# EAGLE design schematic_gprs_old (EAGLE 7.5.0)
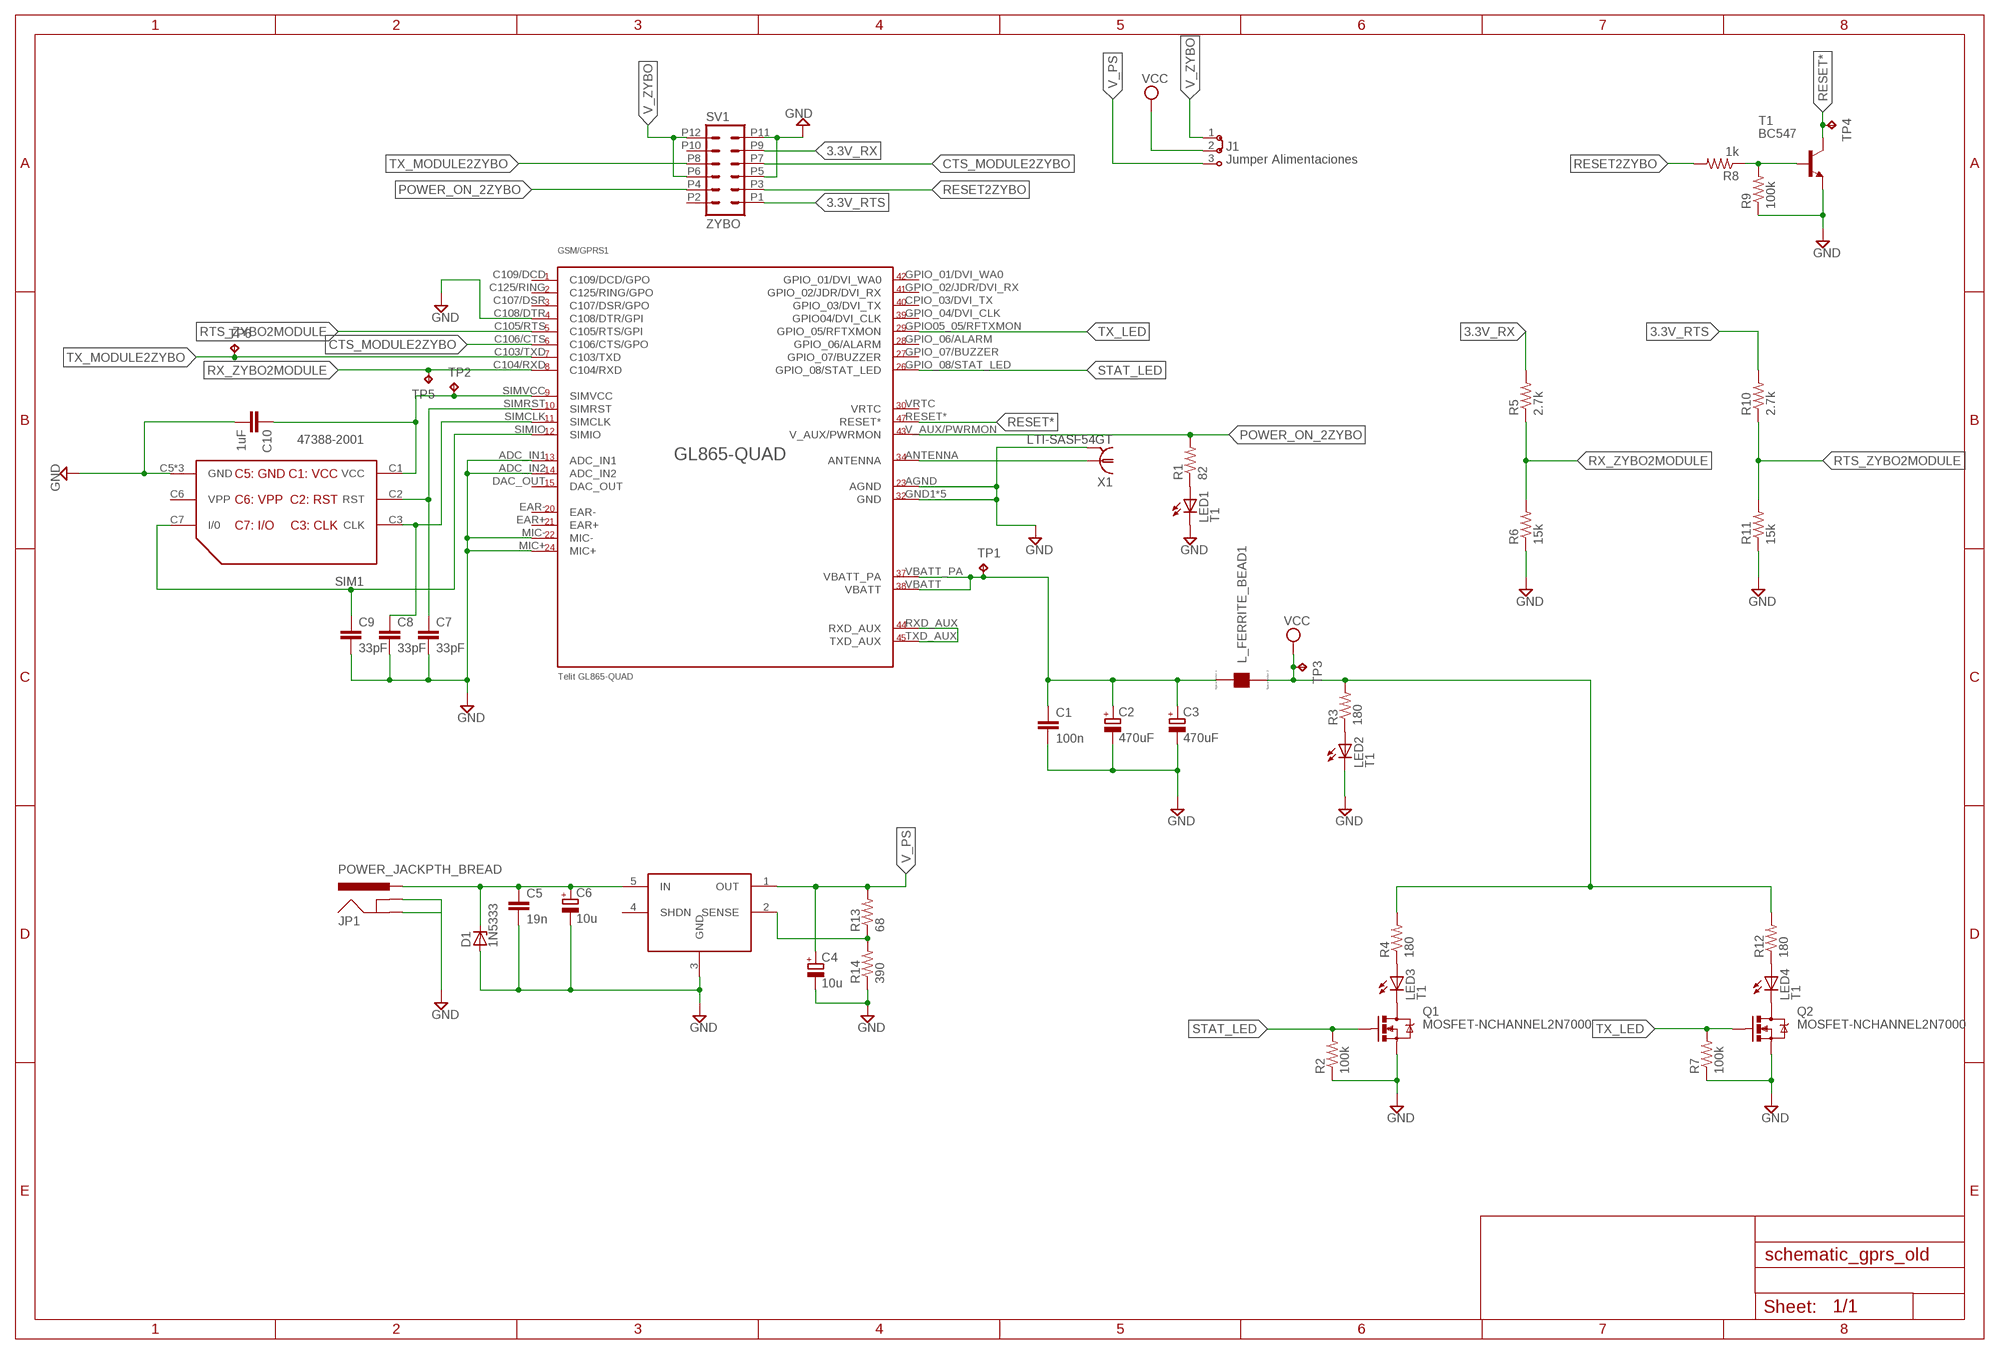
[diagram p0: schematic, sheet 1]

## Parts
C1  100n  C2.5/2  [C2.5-2]
C2  470uF  CPOL-EUE3.5-8  [E3,5-8]
C3  470uF  CPOL-EUE3.5-8  [E3,5-8]
C4  10u  CPOL-EUE2-5  [E2-5]
C5  19n  C-EU050-025X075  [C050-025X075]
C6  10u  CPOL-EUE1.8-4  [E1,8-4]
C7  33pF  C-EU025-024X044  [C025-024X044]
C8  33pF  C-EU025-024X044  [C025-024X044]
C9  33pF  C-EU025-024X044  [C025-024X044]
C10  1uF  CAPKIT  [CAP-PTH-SMALL-KIT]
D1  1N5333  [C1702-15]
GSM/GPRS1  Telit GL865-QUAD  GL865-QUAD  [GL865-QUAD]
J1  Jumper Alimentaciones  J2X2MM  [04C]
JP1  POWER_JACKPTH_BREAD  [POWER_JACK_PTH_BREAD]
L_FERRITE_BEAD1  FERRITEBEAD2  [0207/7]
LED1  T1  LED3MM  [LED3MM]
LED2  T1  LED3MM  [LED3MM]
LED3  T1  LED3MM  [LED3MM]
LED4  T1  LED3MM  [LED3MM]
Q1  MOSFET-NCHANNEL2N7000  [TO-92]
Q2  MOSFET-NCHANNEL2N7000  [TO-92]
R1  82  R-US_0207/7  [0207/7]
R2  100k  R-US_0207/7  [0207/7]
R3  180  R-US_0207/7  [0207/7]
R4  180  R-US_0207/7  [0207/7]
R5  2.7k  R-US_0207/7  [0207/7]
R6  15k  R-US_0207/7  [0207/7]
R7  100k  R-US_0207/7  [0207/7]
R8  1k  R-US_0207/7  [0207/7]
R9  100k  R-US_0207/7  [0207/7]
R10  2.7k  R-US_0207/7  [0207/7]
R11  15k  R-US_0207/7  [0207/7]
R12  180  R-US_0207/7  [0207/7]
R13  68  R-US_0207/7  [0207/7]
R14  390  R-US_0207/7  [0207/7]
SIM1  47388-2001  [47388-2001]
SV1  ZYBO  MA06-2  [MA06-2]
T1  BC547  [TO92]
TP1  TPPAD1-13  [P1-13]
TP2  TPPAD1-13  [P1-13]
TP3  TPPAD1-13  [P1-13]
TP4  TPPAD1-13  [P1-13]
TP5  TPPAD1-13  [P1-13]
TP6  TPPAD1-13  [P1-13]
U$1  LT1528  [Q5-DD]
X1  LTI-SASF54GT  [LTI-SASF54GT]

## Nets
3.3V_RTS: R10.2 SV1.P1
3.3V_RX: R5.2 SV1.P9
CTS_MODULE2ZYBO: GSM/GPRS1.C106/CTS(C106/CTS/GPO) SV1.P7
GND: C1.2 C2.- C3.- C4.- C5.2 C6.- C7.2 C8.2 C9.2 C10.2 D1.A GSM/GPRS1.ADC_IN1 GSM/GPRS1.ADC_IN2 GSM/GPRS1.AGND GSM/GPRS1.C108/DTR(C108/DTR/GPI) GSM/GPRS1.GND1(GND) GSM/GPRS1.GND2(GND) GSM/GPRS1.GND3(GND) GSM/GPRS1.GND4(GND) GSM/GPRS1.GND5(GND) GSM/GPRS1.MIC+ GSM/GPRS1.MIC- JP1.GND JP1.GNDBREAK LED1.K(C) LED2.K(C) Q1.1(S) Q2.1(S) R2.1 R6.1 R7.1 R9.1 R11.1 R14.1 SIM1.C5(GND) SIM1.GND1(GND) SIM1.GND2(GND) SV1.P5 SV1.P11 T1.1(E) U$1.3(GND) X1.2 X1.3 X1.4 X1.5
N$1: GSM/GPRS1.ANTENNA X1.1
N$2: C10.1 GSM/GPRS1.SIMVCC SIM1.C1(VCC) TP2.TP
N$3: LED4.A R12.1
N$4: C7.1 GSM/GPRS1.SIMRST SIM1.C2(RST)
N$5: C8.1 GSM/GPRS1.SIMCLK SIM1.C3(CLK)
N$6: C9.1 GSM/GPRS1.SIMIO SIM1.C7(I/0)
N$7: R8.1 R9.2 T1.2(B)
N$8: LED1.A R1.1
N$9: LED4.K(C) Q2.3(D)
N$10: C1.1 C2.+ C3.+ GSM/GPRS1.VBATT GSM/GPRS1.VBATT_PA L_FERRITE_BEAD1.1(A) TP1.TP
N$11: C5.1 C6.+ D1.C JP1.PWR U$1.5(IN)
N$12: LED3.A R4.1
N$13: LED3.K(C) Q1.3(D)
N$14: R13.1 R14.2 U$1.2(SENSE)
N$15: LED2.A R3.1
N$17: GSM/GPRS1.RXD_AUX GSM/GPRS1.TXD_AUX
POWER_ON_2ZYBO: GSM/GPRS1.V_AUX/PWRMON R1.2 SV1.P4
RESET2ZYBO: R8.2 SV1.P3
RESET*: GSM/GPRS1.RESET* T1.3(C) TP4.TP
RTS_ZYBO2MODULE: GSM/GPRS1.C105/RTS(C105/RTS/GPI) R10.1 R11.2
RX_ZYBO2MODULE: GSM/GPRS1.C104/RXD R5.1 R6.2 TP5.TP
STAT_LED: GSM/GPRS1.GPIO_08/STAT_LED Q1.2(G) R2.2
TX_LED: GSM/GPRS1.GPIO05_05/RFTXMON(GPIO_05/RFTXMON) Q2.2(G) R7.2
TX_MODULE2ZYBO: GSM/GPRS1.C103/TXD SV1.P8 TP6.TP
V_PS: C4.+ J1.3 R13.2 U$1.1(OUT)
V_ZYBO: J1.1 SV1.P6 SV1.P12
VCC: J1.2 L_FERRITE_BEAD1.2(B) R3.2 R4.2 R12.2 TP3.TP
Unconnected: GSM/GPRS1.C107/DSR(C107/DSR/GPO) GSM/GPRS1.C109/DCD(C109/DCD/GPO) GSM/GPRS1.C125/RING(C125/RING/GPO) GSM/GPRS1.CPIO_03/DVI_TX(GPIO_03/DVI_TX) GSM/GPRS1.DAC_OUT GSM/GPRS1.EAR+ GSM/GPRS1.EAR- GSM/GPRS1.GPIO_01/DVI_WA0 GSM/GPRS1.GPIO_02/JDR/DVI_RX GSM/GPRS1.GPIO_04/DVI_CLK(GPIO04/DVI_CLK) GSM/GPRS1.GPIO_06/ALARM GSM/GPRS1.GPIO_07/BUZZER GSM/GPRS1.VRTC SIM1.C6(VPP) SV1.P2 SV1.P10 U$1.4(SHDN)

## Library data of the parts
C1 = capacitor-wima:C: CAPACITOR naming: grid - package width
C2-C4 C6 = resistor:CPOL-EU: POLARIZED CAPACITOR, European symbol
C5 = resistor:C-EU: CAPACITOR, European symbol
C7-C9 = rcl:C-EU: CAPACITOR, European symbol
C10 = SparkFun-Capacitors:CAP: Capacitor Standard 0603 ceramic capacitor, and 0.1" leaded capacitor.
D1 = diode:1N5333: Z DIODE 3.3 V, 5W, 5 percent (Motorola)
GSM/GPRS1 = TelitGL865:GL865-QUAD: Telit GSM/GPRS module GL865-DUAL and GL865-QUAD.
J1 = jumper:J2: Jumper switch 2 x 2.5 mm
JP1 = SparkFun-Connectors:POWER_JACK: Power Jack This is the standard 5.5mm barrel jack for power. The PTH is the most common, proven, reliable, footprint. The Slot footprint only works if the mill layer is transmitted to the PCB fab house so be warned. Mating wall wart : TOL-00298 (and others); PROD_ID: PRT-10811
L_FERRITE_BEAD1 = sym:FERRITEBEAD2: A Ferrite Bead(Alternate symbol)
LED1-LED4 = led:LED: LED OSRAM: - CHIPLED LG R971, LG N971, LY N971, LG Q971, LY Q971, LO R971, LY R971 LH N974, LH R974 LS Q976, LO Q976, LY Q976 LO Q996 - Hyper CHIPLED LW Q18S LB Q993, LB Q99A, LB R99A - SideLED LS A670, LO A670, LY A670, LG A670, LP A670 LB A673, LV A673, LT A673, LW A673 LH A674 LY A675 LS A676, LA A676, LO A676, LY A676, LW A676 LS A679, LY A679, LG A679 - Hyper Micro SIDELED® LS Y876, LA Y876, LO Y876, LY Y876 LT Y87S - SmartLED LW L88C, LW L88S LB L89C, LB L89S, LG L890 LS L89K, LO L89K, LY L89K LS L896, LA L896, LO L896, LY L896 - TOPLED LS T670, LO T670, LY T670, LG T670, LP T670 LSG T670, LSP T670, LSY T670, LOP T670, LYG T670 LG T671, LOG T671, LSG T671 LB T673, LV T673, LT T673, LW T673 LH T674 LS T676, LA T676, LO T676, LY T676, LB T676, LH T676, LSB T676, LW T676 LB T67C, LV T67C, LT T67C, LS T67K, LO T67K, LY T67K, LW E67C LS E67B, LA E67B, LO E67B, LY E67B, LB E67C, LV E67C, LT E67C LW T67C LS T679, LY T679, LG T679 LS T770, LO T770, LY T770, LG T770, LP T770 LB T773, LV T773, LT T773, LW T773 LH T774 LS E675, LA E675, LY E675, LS T675 LS T776, LA T776, LO T776, LY T776, LB T776 LHGB T686 LT T68C, LB T68C - Hyper Mini TOPLED® LB M676 - Mini TOPLED Santana® LG M470 LS M47K, LO M47K, LY M47K Source: http://www.osram.convergy.de LUXEON: - LUMILED® LXK2-PW12-R00, LXK2-PW12-S00, LXK2-PW14-U00, LXK2-PW14-V00 LXK2-PM12-R00, LXK2-PM12-S00, LXK2-PM14-U00 LXK2-PE12-Q00, LXK2-PE12-R00, LXK2-PE12-S00, LXK2-PE14-T00, LXK2-PE14-U00 LXK2-PB12-K00, LXK2-PB12-L00, LXK2-PB12-M00, LXK2-PB14-N00, LXK2-PB14-P00, LXK2-PB14-Q00 LXK2-PR12-L00, LXK2-PR12-M00, LXK2-PR14-Q00, LXK2-PR14-R00 LXK2-PD12-Q00, LXK2-PD12-R00, LXK2-PD12-S00 LXK2-PH12-R00, LXK2-PH12-S00 LXK2-PL12-P00, LXK2-PL12-Q00, LXK2-PL12-R00 Source: www.luxeon.com KINGBRIGHT: KA-3528ASYC Source: www.kingbright.com
Q1 Q2 = SparkFun-DiscreteSemi:MOSFET-NCHANNEL: Common NMOSFET Parts MFG P/N Store ID Prod ID FDD8780 TRANS-09984 SI7820DN TRANS-11055 FDS6630A IC-08089 2N7002PW TRANS-11151 FQP30N06L COM-10213 TRANS-10060 BSS123LT1G TRANS-08345 BSS138 TRANS-00830 BS170 2N7000
R1-R14 = resistor:R-US_: RESISTOR, American symbol
SIM1 = con-molex-simcard:47388-2001: SIM HOLDER 47388-2001 de MOLEX
SV1 = con-lstb:MA06-2: PIN HEADER It was adapted to work with PMOD ZYBO connector
T1 = transistor:BC547: NPN TRANSISTOR
TP1-TP6 = testpad:TP: Test pad
U$1 = SparkFun-PowerIC:LT1528: High current voltage regulator commonly used with GM862 cellular module. Spark Fun Electronics SKU : COM-00311. Footprint may need to have the large paste aperature reduced.
X1 = con-coax:LTI-SASF54GT: SMA vertical PCB thrue hole jack Source: Lighthorse Technologies, inc. SASF54GT.pdf; OC_FARNELL: unknown; OC_NEWARK: unknown

## Board
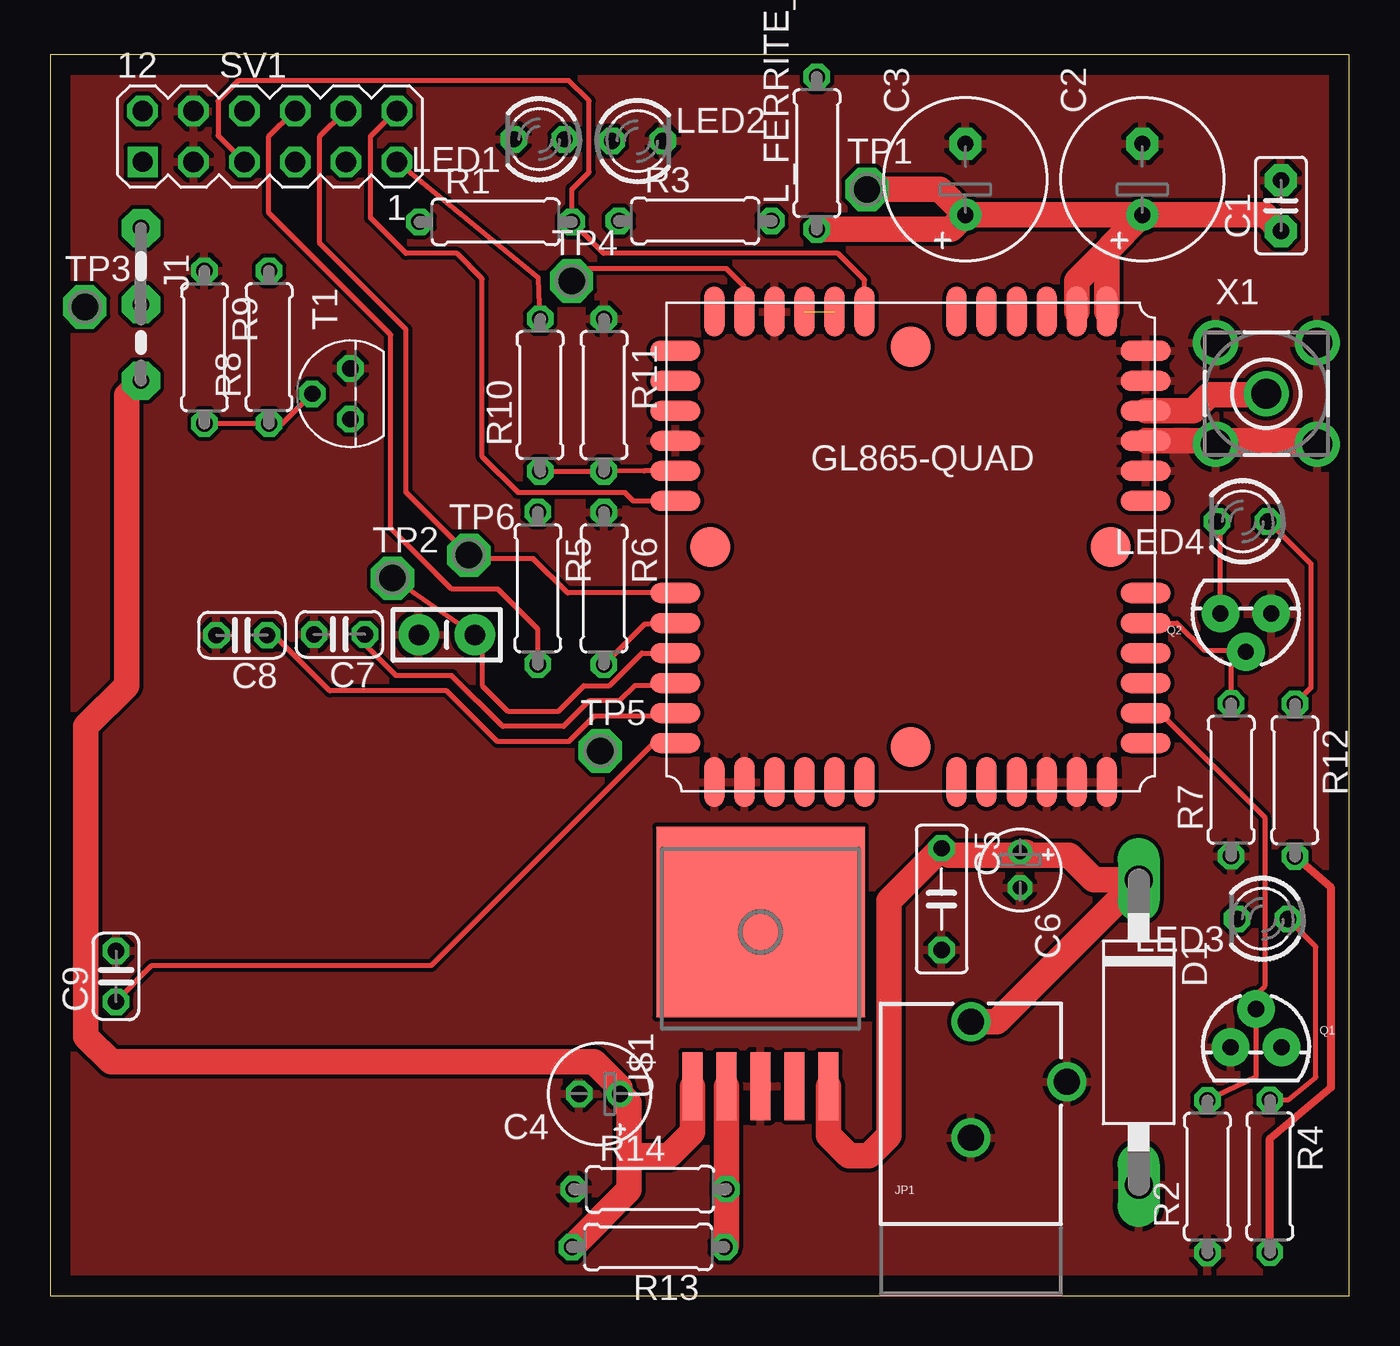
[diagram p1: board, top side]
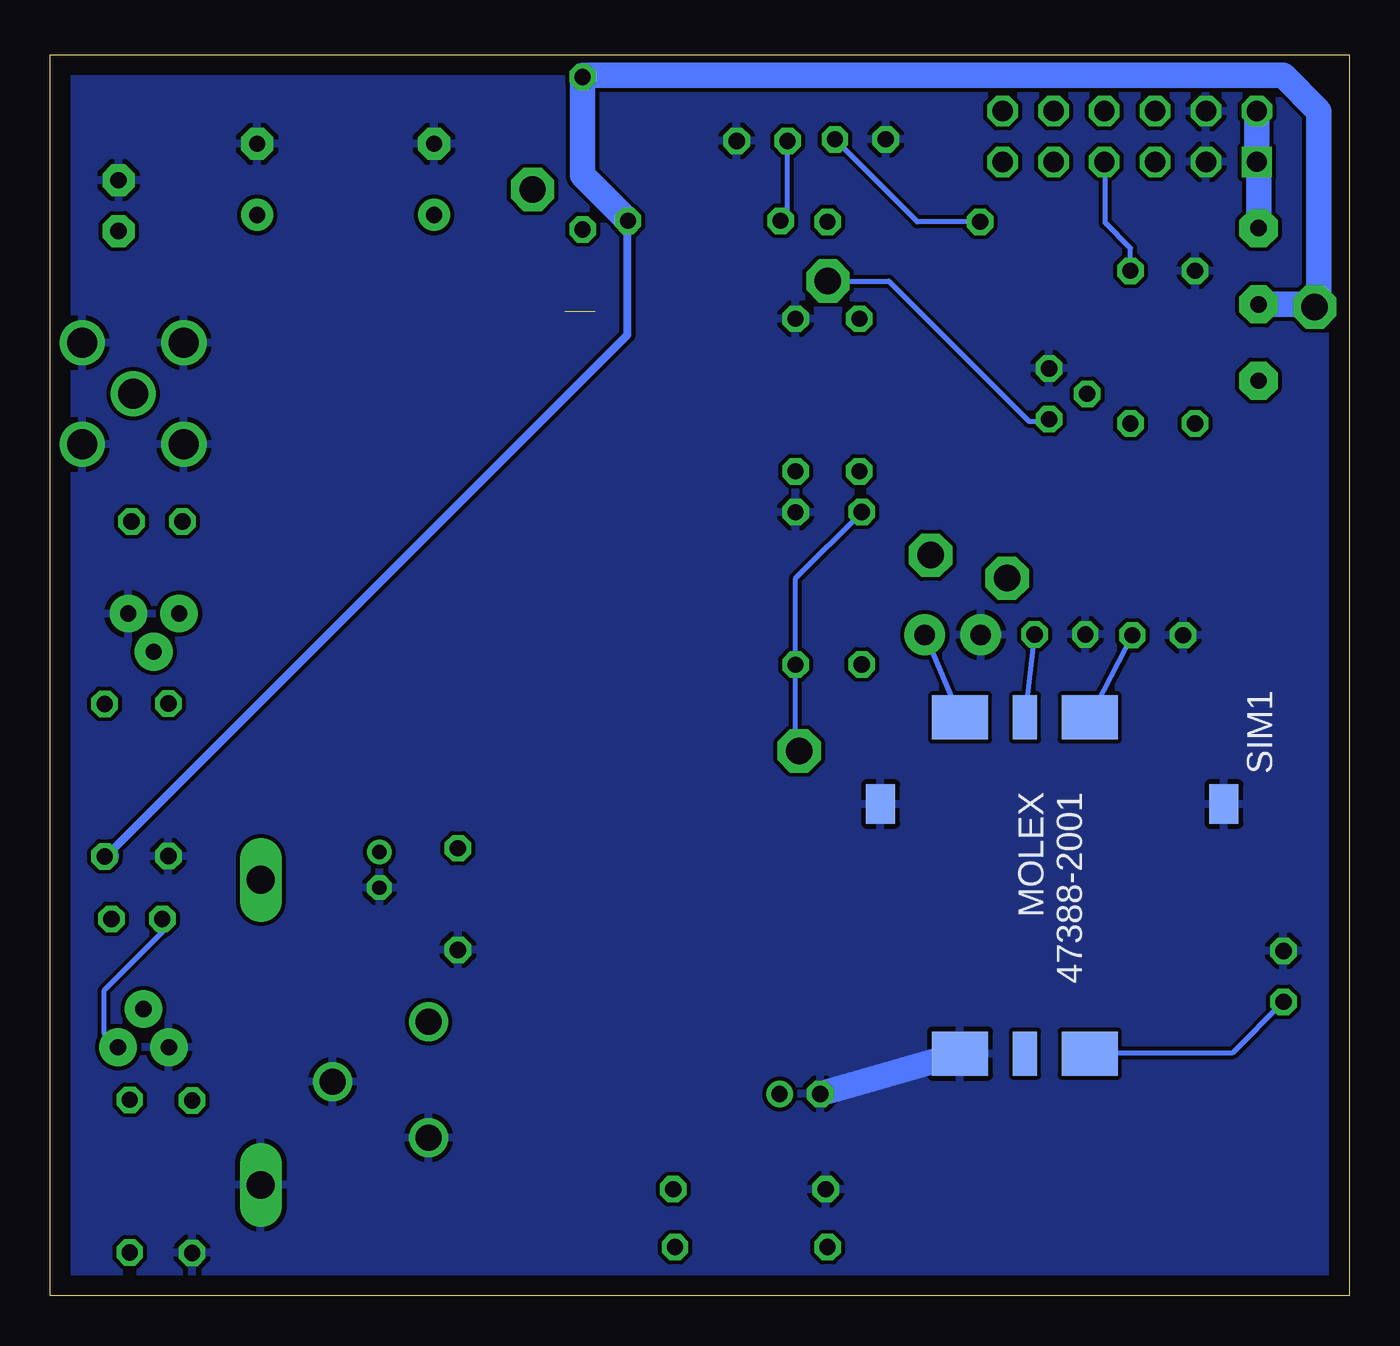
[diagram p2: board, bottom side, seen from below]

Size 64.93 x 62 mm. Coordinates in mm from the lower left corner, seen from the top.
Outline: 0.01,0 64.93,0 64.93,62 0,62 0.01,0
Copper layers (1*16): Top 0.15mm / dielectric 1.5mm / Bottom 0.15mm
Design rules "default *": minimum track width 10mil, minimum drill 24mil, track to track 8mil, track to pad 8mil, pad to pad 8mil, via to via 8mil, smd to smd 8mil, copper to edge 40mil, drill to drill 8mil, minimum pad ring 10mil, minimum via ring 8mil, stop-mask expansion 4mil, vias tented up to drill 0mil, thermal gap 10mil

### Footprints (pad centres in the part's own frame; a part is rotated, then mirrored left to right if it is on the bottom)
C2.5-2 = drill 0.813 pad 1.6 octagon: 1 -1.27,0; 2 1.27,0
E3,5-8 = drill 0.813 pad 1.6: + -1.778,0 | drill 0.813 pad 1.6 octagon: - 1.778,0
E2-5 = drill 0.813 pad 1.27: + -1.016,0 | drill 0.813 pad 1.27 octagon: - 1.016,0
C050-025X075 = drill 0.813 octagon: 1 -2.54,0; 2 2.54,0
E1,8-4 = drill 0.711 pad 1.168: + -0.889,0 | drill 0.711 pad 1.168 octagon: - 0.889,0
C025-024X044 = drill 0.813 octagon: 1 -1.27,0; 2 1.27,0
CAP-PTH-SMALL-KIT = drill 1.016 pad 2.032: 1 -1.397,0; 2 1.397,0
C1702-15 = drill 1.397 long: A 7.62,0; C -7.62,0
GL865-QUAD = smd 1 x 2.5: ADC_IN1 2.4,0.45; ADC_IN2 3.9,0.45; AGND 20.5,0.45; CPIO_03/DVI_TX 17.5,23.95; DAC_OUT 5.4,0.45; EAR+ 17.5,0.45; EAR- 16,0.45; GND5 5.4,23.95; GPIO_01/DVI_WA0 14.5,23.95; GPIO_02/JDR/DVI_RX 16,23.95; GPIO_04/DVI_CLK 19,23.95; MIC+ 22,0.45; MIC- 19,0.45; NC/RFU1 6.9,0.45; NC/RFU2 8.4,0.45; NC/RFU3 9.9,0.45; NC/RFU4 14.5,0.45; NC/RFU7 2.4,23.95; RESET* 3.9,23.95; RXD_AUX 8.4,23.95; TXD_AUX 6.9,23.95; V_AUX/PWRMON 9.9,23.95; VBATT 20.5,23.95; VBATT_PA 22,23.95 | smd 2.5 x 1: ANTENNA 23.95,19; C103/TXD 0.45,9.9; C104/RXD 0.45,8.4; C105/RTS 0.45,16; C106/CTS 0.45,14.5; C107/DSR 0.45,19; C108/DTR 0.45,17.5; C109/DCD 0.45,22; C125/RING 0.45,20.5; GND1 23.95,16; GND2 23.95,17.5; GND3 23.95,20.5; GND4 23.95,22; GPIO05_05/RFTXMON 23.95,8.4; GPIO_06/ALARM 23.95,6.9; GPIO_07/BUZZER 23.95,5.4; GPIO_08/STAT_LED 23.95,3.9; NC/RFU5 23.95,2.4; NC/RFU6 23.95,14.5; SIMCLK 0.45,3.9; SIMIO 0.45,2.4; SIMRST 0.45,5.4; SIMVCC 0.45,6.9; VRTC 23.95,9.9 | smd 2 x 2: P$1 2.2,12.2; P$2 22.2,12.2; P$3 12.2,22.2; P$4 12.2,2.2
04C = drill 0.813 pad 1.905 octagon: 1 -1.905,0; 2 1.905,0; 3 5.715,0
POWER_JACK_PTH_BREAD = drill 1.3: GND 0,7.9; GNDBREAK 4.8,10.7; PWR 0,13.7
0207/7 = drill 0.813 octagon: 1 -3.81,0; 2 3.81,0
LED3MM = drill 0.813 octagon: A -1.27,0; K 1.27,0
TO-92 = drill 0.813 pad 1.88: 1 -1.27,0; 2 0,1.905; 3 1.27,0
47388-2001 = smd 2.2 x 2.8: C1 1.36,4.705; C3 1.36,11.185; C5 18.16,4.705; C7 18.16,11.185 | smd 2.2 x 1.2: C2 1.36,7.945; C6 18.16,7.945 | smd 1.95 x 1.45: GND1 5.69,17.885; GND2 5.69,0.725
MA06-2 = drill 1.016 octagon: P1 6.35,-1.27; P2 3.81,-1.27; P3 1.27,-1.27; P4 -1.27,-1.27; P5 -3.81,-1.27; P7 6.35,1.27; P8 3.81,1.27; P9 1.27,1.27; P10 -1.27,1.27; P11 -3.81,1.27; P12 -6.35,1.27 | drill 1 square: P6 -6.35,-1.27
TO92 = drill 0.813 octagon: 1 1.27,0; 2 0,1.905; 3 -1.27,0
P1-13 = drill 1.321 pad 2.159 octagon: TP 0,0
Q5-DD = smd 1 x 3.4: 1 -3.4,-7.875; 2 -1.7,-7.875; 3 0,-7.875; 4 1.7,-7.875; 5 3.4,-7.875 | smd 10.414 x 9.525: 6 0,0.325
LTI-SASF54GT = drill 1.5 pad 2.2: 1 0,0; 2 -2.54,2.54; 3 2.54,2.54; 4 2.54,-2.54; 5 -2.54,-2.54

### Placement (x,y rotation side)
C1  61.51,54.46 90 top
C2  54.58,55.77 90 top
C3  45.74,55.77 90 top
C4  27.46,10.09 180 top
C5  44.55,19.82 270 top
C6  48.47,21.28 270 top
C7  14.47,33.04 180 top
C8  9.58,33 180 top
C9  3.3,15.96 90 top
C10  19.82,33.02 180 top
D1  54.4,13.16 270 top
GSM/GPRS1  30.8,25.21 0 top
J1  4.54,51.43 270 top
JP1  46.01,0 0 top
L_FERRITE_BEAD1  38.32,57.08 90 top
LED1  24.44,57.77 180 top
LED2  29.35,57.69 0 top
LED3  60.59,18.83 180 top
LED4  59.59,38.68 180 top
Q1  60.26,12.42 0 top
Q2  59.75,34.08 180 top
R1  22.27,53.65 0 top
R2  57.83,5.96 90 top
R3  32.24,53.7 0 top
R4  60.95,5.98 270 top
R5  24.37,35.35 270 top
R6  27.68,35.34 270 top
R7  59.02,25.78 90 top
R8  10.94,47.39 90 top
R9  7.71,47.39 270 top
R10  24.49,45 90 top
R11  27.68,45 270 top
R12  62.2,25.76 270 top
R13  29.89,2.44 180 top
R14  29.98,5.33 0 top
SIM1  24.16,30.26 270 bottom
SV1  10.98,57.91 0 top
T1  15.01,45.06 90 top
TP1  40.82,55.27 0 top
TP2  17.11,35.85 0 top
TP3  1.74,49.4 0 top
TP4  26.06,50.69 0 top
TP5  27.5,27.22 0 top
TP6  20.93,37 0 top
U$1  35.5,18.35 0 top
X1  60.78,45.07 0 top

### Tracks (layer width: path | path; a pad name or v marks a point on that pad's centre or on a via)
3.3V_RTS
  Top 0.254: R10.2 24.4,50.84 SV1.P1
3.3V_RX
  Top 0.254: SV1.P9 12.2,59.18 10.93,57.91 10.93,54.1 17.03,48.01 17.03,38.35 20.08,35.31 22.38,35.31 24.37,33.32 R5.2
CTS_MODULE2ZYBO
  Top 0.254: SV1.P7 17.28,59.18 16.01,57.91 16.01,53.85 17.79,52.07 20.33,52.07 21.6,50.8 21.6,41.91 23.38,40.13 28.71,40.13 29.13,39.71 GSM/GPRS1.C106/CTS
GND
  Top 1.27: GSM/GPRS1.GND2 63.14,42.71 X1.4
  Bottom 1.27: C4.- SIM1.C5
  pour Bottom: 0.01,0 64.93,0 64.93,62 0.01,62
  pour Top: 0.01,0 64.93,0 64.93,62 0.01,62
N$1
  Top 1.27: GSM/GPRS1.ANTENNA 57.14,44.21 57.93,45 60.71,45 X1.1
N$2
  Top 0.254: TP2.TP C10.1 21.6,32.64 21.6,30.48 22.87,29.21 25.41,29.21 26.68,30.48 27.95,30.48 29.58,32.11 GSM/GPRS1.SIMVCC
  Bottom 0.254: C10.1 SIM1.C1
N$3
  Top 0.254: LED4.A 60.9,38.68 63,36.58 63,30.37 R12.1
N$4
  Top 0.254: GSM/GPRS1.SIMRST 31.12,30.48 29.22,30.48 28.46,29.72 26.93,29.72 25.66,28.45 22.62,28.45 20.08,30.99 17.28,30.99 15.74,32.53 C7.1
  Bottom 0.254: C7.1 SIM1.C2
N$5
  Top 0.254: GSM/GPRS1.SIMCLK 31.1,28.96 27.19,28.96 25.92,27.69 22.36,27.69 19.82,30.23 13.98,30.23 11.21,33 C8.1
  Bottom 0.254: C8.1 SIM1.C3
N$6
  Top 0.254: GSM/GPRS1.SIMIO 30.16,27.61 19.06,16.51 5.09,16.51 3.3,14.72 C9.1
  Bottom 0.254: SIM1.C7 12.92,12.15 5.84,12.15 C9.1
N$7
  Top 0.254: R9.2 R8.1 11.63,43.58 T1.2
N$8
  Bottom 0.254: R1.1 21.59,53.65 LED1.A
N$9
  Top 0.254: Q2.3 58.48,38.52 LED4.K
N$10
  Top 1.27: C3.+ 45.02,53.27 L_FERRITE_BEAD1.1 38.82,53.27 | C3.+ C2.+ | C2.+ 60.71,53.99 C1.1 | GSM/GPRS1.VBATT_PA 52.8,52.21 C2.+ | GSM/GPRS1.VBATT 51.3,50.71 C2.+ | TP1.TP 44.46,55.27 C3.+
N$11
  Top 1.27: JP1.PWR 47.32,13.7 D1.C 52.15,20.78 50.93,22 48.93,22 | 48.93,22 48.64,22 | 48.64,22 C6.+ 48.76,22.17 48.93,22 | 48.64,22 44.91,22 C5.1 41.93,19.74 41.93,8 40.93,7 39.93,7 38.9,8.03 U$1.5
N$12
  Top 0.254: R4.1 61.87,9.79 63.26,10.92 63.26,17.43 LED3.A
N$13
  Bottom 0.254: LED3.K 59.32,18.16 62.24,15.24 62.24,13.13 Q1.3
N$14
  Top 1.27: U$1.2 R14.2 33.79,2.53 R13.1
N$15
  Bottom 0.254: R3.1 28.08,54.05 LED2.A
N$17  (1 unrouted)
POWER_ON_2ZYBO
  Top 0.254: GSM/GPRS1.V_AUX/PWRMON 40.7,50.75 39.38,52.07 27.66,52.07 R1.2 26.08,55.28 26.93,56.13 26.93,59.69 25.92,60.71 9.41,60.71 8.39,59.69 8.39,57.96 SV1.P4
RESET2ZYBO
  Bottom 0.254: R8.2 10.94,52.34 12.2,53.59 12.2,56.59 SV1.P3
RESET*
  Top 0.254: GSM/GPRS1.RESET* 34.7,50.4 33.79,51.31 26.68,51.31 TP4.TP
  Bottom 0.254: TP4.TP 23.02,50.69 16.01,43.69 15.11,43.69 T1.3
RTS_ZYBO2MODULE
  Top 0.254: R10.1 R11.2 29.69,41.21 GSM/GPRS1.C105/RTS
RX_ZYBO2MODULE
  Top 0.254: GSM/GPRS1.C104/RXD 31.2,33.56 29.71,33.56 R6.2
  Bottom 0.254: 27.7,31.8 27.7,35.81 24.37,39.14 R5.1 | 27.7,31.8 R6.2 | 27.7,31.8 27.7,27.42 TP5.TP
STAT_LED
  Top 0.254: GSM/GPRS1.GPIO_08/STAT_LED 55.48,29.11 60.72,23.88 60.72,15.49 60.26,15.04 Q1.2 60.26,10.93 R2.2
TX_LED
  Top 0.254: R7.2 59.02,31.45 Q2.2 59.67,32.26 57.67,32.26 56.32,33.61 GSM/GPRS1.GPIO05_05/RFTXMON
TX_MODULE2ZYBO
  Top 0.254: GSM/GPRS1.C103/TXD 25.86,35.11 24.14,36.83 21.1,36.83 TP6.TP 17.79,40.14 17.79,48.26 13.47,52.58 13.47,57.91 14.74,59.18 SV1.P8
V_PS
  Top 1.27: U$1.1 32.1,8.17 30.93,7 28.93,7 | 28.93,7 28.93,9.64 C4.+ 28.48,10.4 27.19,11.68 3.06,11.68 1.79,12.95 1.79,28.45 3.82,30.48 3.82,44.99 J1.3 | 28.93,7 28.93,5.29 R13.2
V_ZYBO
  Bottom 1.27: SV1.P12 SV1.P6 4.54,56.55 J1.1
VCC
  Top 0.406: R4.2 60.95,7.85 64.02,10.41 64.02,20.39 R12.2
  Bottom 0.406: 62.13,21.95 36.08,48.01 36.08,53.67
  Bottom 1.27: J1.2 1.74,49.52 TP3.TP 1.53,49.4 1.53,59.18 3.31,60.96 38.25,60.96 L_FERRITE_BEAD1.2 38.32,55.97 R3.2 36.08,53.67 | R12.2 62.13,21.95